# Altium schematic sheet 3 ports.SchDoc
size A4; DocumentNumber: 3; SheetNumber: 5; SheetTotal: 12
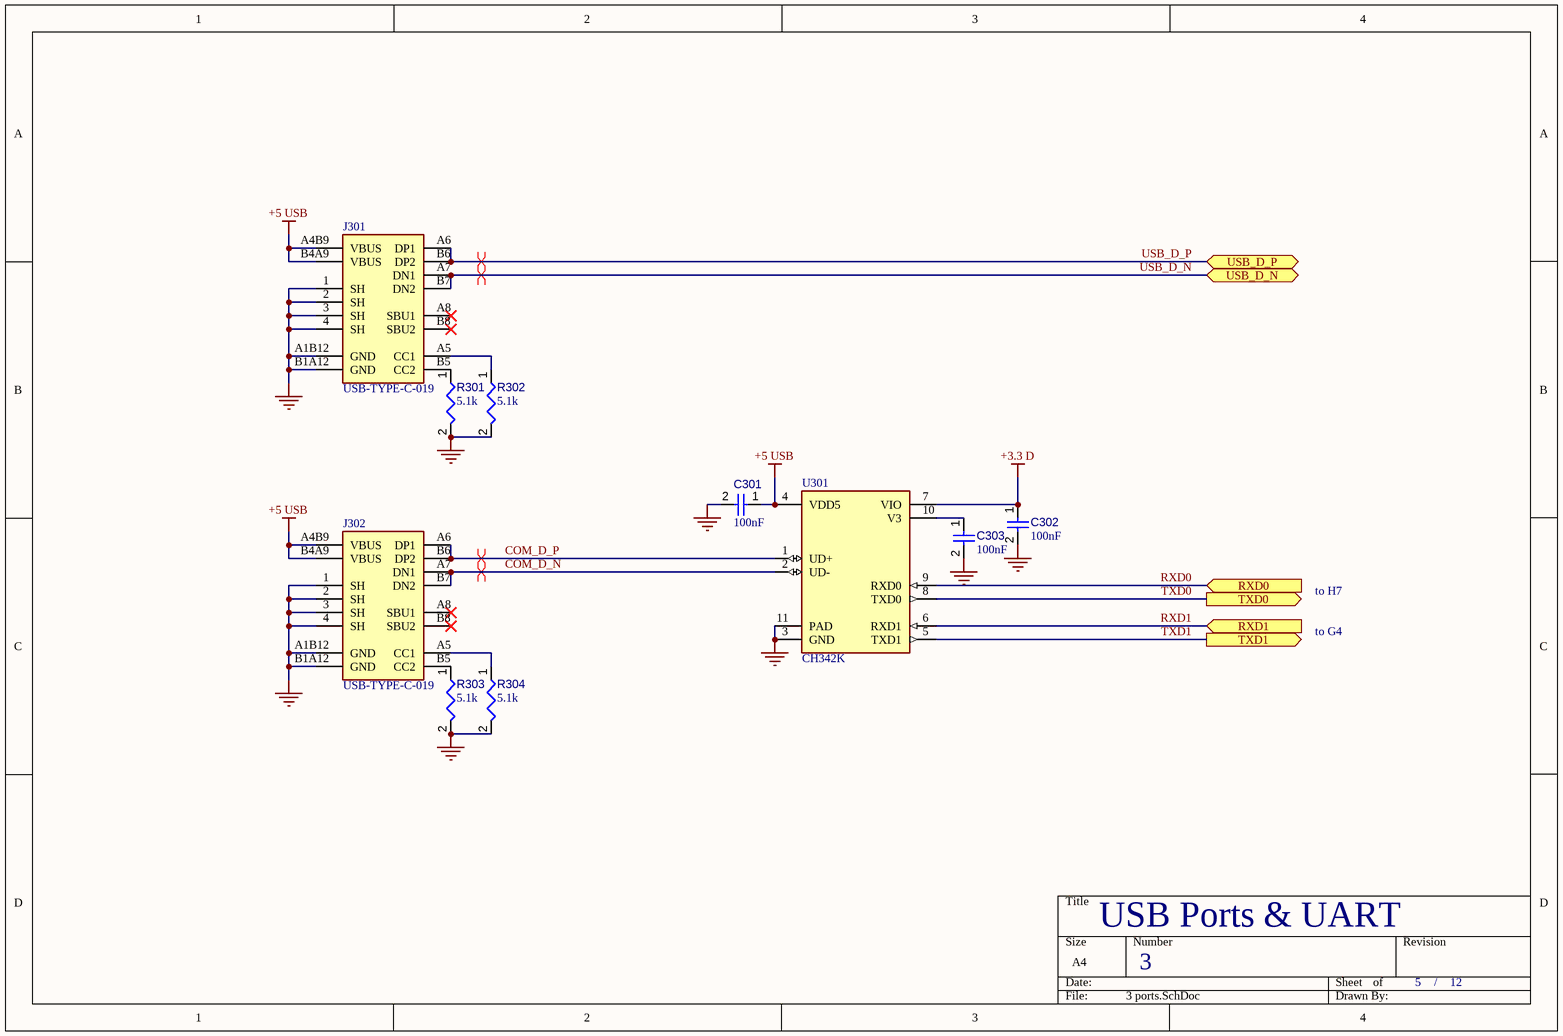
[diagram p0: 3 ports.SchDoc]

## Parts
C301  value 100nF  [CAPC0402(1005)60_L]  (hidden comment: Capacitor 100nF +/-20% 25V 0402)
C302  value 100nF  [CAPC0402(1005)60_L]  (hidden comment: Capacitor 100nF +/-20% 25V 0402)
C303  value 100nF  [CAPC0402(1005)60_L]  (hidden comment: Capacitor 100nF +/-20% 25V 0402)
J301  USB-TYPE-C-019  [USB-TYPE-C-12+4P]
J302  USB-TYPE-C-019  [USB-TYPE-C-12+4P]
R301  value 5.1k  [RESC0402(1005)_L]  (hidden comment: Resistor 5K1  +/-1 % 0402 63 mW)
R302  value 5.1k  [RESC0402(1005)_L]  (hidden comment: Resistor 5K1  +/-1 % 0402 63 mW)
R303  value 5.1k  [RESC0402(1005)_L]  (hidden comment: Resistor 5K1  +/-1 % 0402 63 mW)
R304  value 5.1k  [RESC0402(1005)_L]  (hidden comment: Resistor 5K1  +/-1 % 0402 63 mW)
U301  CH342K  [SSOP-10_L5.0-W3.9-P1.00-LS6.0-BL-EP]

## Ports
RXD0 (in), RXD1 (in), TXD0 (out), TXD1 (out), USB_D_N (bidir), USB_D_P (bidir)

## Nets
+3.3 D: C302.1 U301.7(VIO)
+5 USB: C301.1 J301.A4B9(VBUS) J301.B4A9(VBUS) J302.A4B9(VBUS) J302.B4A9(VBUS) U301.4(VDD5)
GND: C301.2 C302.2 C303.2 J301.1(SH) J301.2(SH) J301.3(SH) J301.4(SH) J301.A1B12(GND) J301.B1A12(GND) J302.1(SH) J302.2(SH) J302.3(SH) J302.4(SH) J302.A1B12(GND) J302.B1A12(GND) R301.2 R302.2 R303.2 R304.2 U301.3(GND) U301.11(PAD)
COM_D_N: J302.A7(DN1) J302.B7(DN2) U301.2(UD-)
COM_D_P: J302.A6(DP1) J302.B6(DP2) U301.1(UD+)
RXD0: U301.9(RXD0) ; port RXD0
RXD1: U301.6(RXD1) ; port RXD1
TXD0: U301.8(TXD0) ; port TXD0
TXD1: U301.5(TXD1) ; port TXD1
USB_D_N: J301.A7(DN1) J301.B7(DN2) ; port USB_D_N
USB_D_P: J301.A6(DP1) J301.B6(DP2) ; port USB_D_P
NetC303_1: C303.1 U301.10(V3)
NetJ301_A5: J301.A5(CC1) R302.1
NetJ301_B5: J301.B5(CC2) R301.1
NetJ302_A5: J302.A5(CC1) R304.1
NetJ302_B5: J302.B5(CC2) R303.1

Not connected (* = marked no-connect by the designer): J301 A8(SBU1)* B8(SBU2)*; J302 A8(SBU1)* B8(SBU2)*

## Layout directives
differential pair: COM_D_N, COM_D_P, USB_D_N, USB_D_P

## Notes on the sheet
- to H7
- to G4
- USB Ports & UART
- /

## Library data of the parts
C301-C303 = CMP-001-00065-4: Chip Capacitor, 100nF +/-20%, 25V, 0402, Thickness 0.6 mm; Tolerance: 10%; Max Operating Temperature: 85°C; Min Operating Temperature: -55°C; Pins: 2; Voltage Rating: 25V; Mounting Technology: SMT; Case/Package: 0402
J301 J302 = USB-TYPE-C-019: Connector Type:Type-C Standard:- Gender:Female Number of Contacts:16 Number of Ports:1 Mounting Style:Surface Mount Current Rating - Power (Max):3A Operating Temperature Range:-25℃~+85℃ Operating Temperature Range:-25℃~+85℃; Manufacturer: DEALON(德艺隆); Add into BOM: yes; Connector Type: Type-C; Gender: Female; Number of Contacts: 16; Number of Ports: 1; Current Rating - Power (Max): 3A; Symbol: USB-TYPE-C-019; Device: USB-TYPE-C-019; LCSC Part Name: Type-C 母座 卧贴; Supplier Part: C2927039; Manufacturer Part: USB-TYPE-C-019; Supplier Footprint: SMD; JLCPCB Part Class: Extended Part; Datasheet: https://atta.szlcsc.com/upload/public/pdf/source/20211217/CCD3D517E355E8E0CC52ABD8D5784AD8.pdf; Supplier: LCSC; Convert to PCB: yes; Standard: -; Mounting Style: Surface Mount; Operating Temperature Range: -25℃~+85℃
R301-R304 = CMP-009-00158-3: Chip Resistor, 5.1 kOhms, +/-1 %, 63 mW, -55 to 155 degC, 0402; Power: 63mW; Tolerance: 1%; Max Operating Temperature: 155°C; Pins: 2; Min Operating Temperature: -55°C; Case/Package: 0402
U301 = CH342K: ESSOP-10-150mil USB Converters ROHS